# Altium schematic sheet Module_blk.SchDoc
size A4; Engineer: JBayalas; DocumentNumber: 5; Revision: V2.0; SheetNumber: 5; SheetTotal: 14
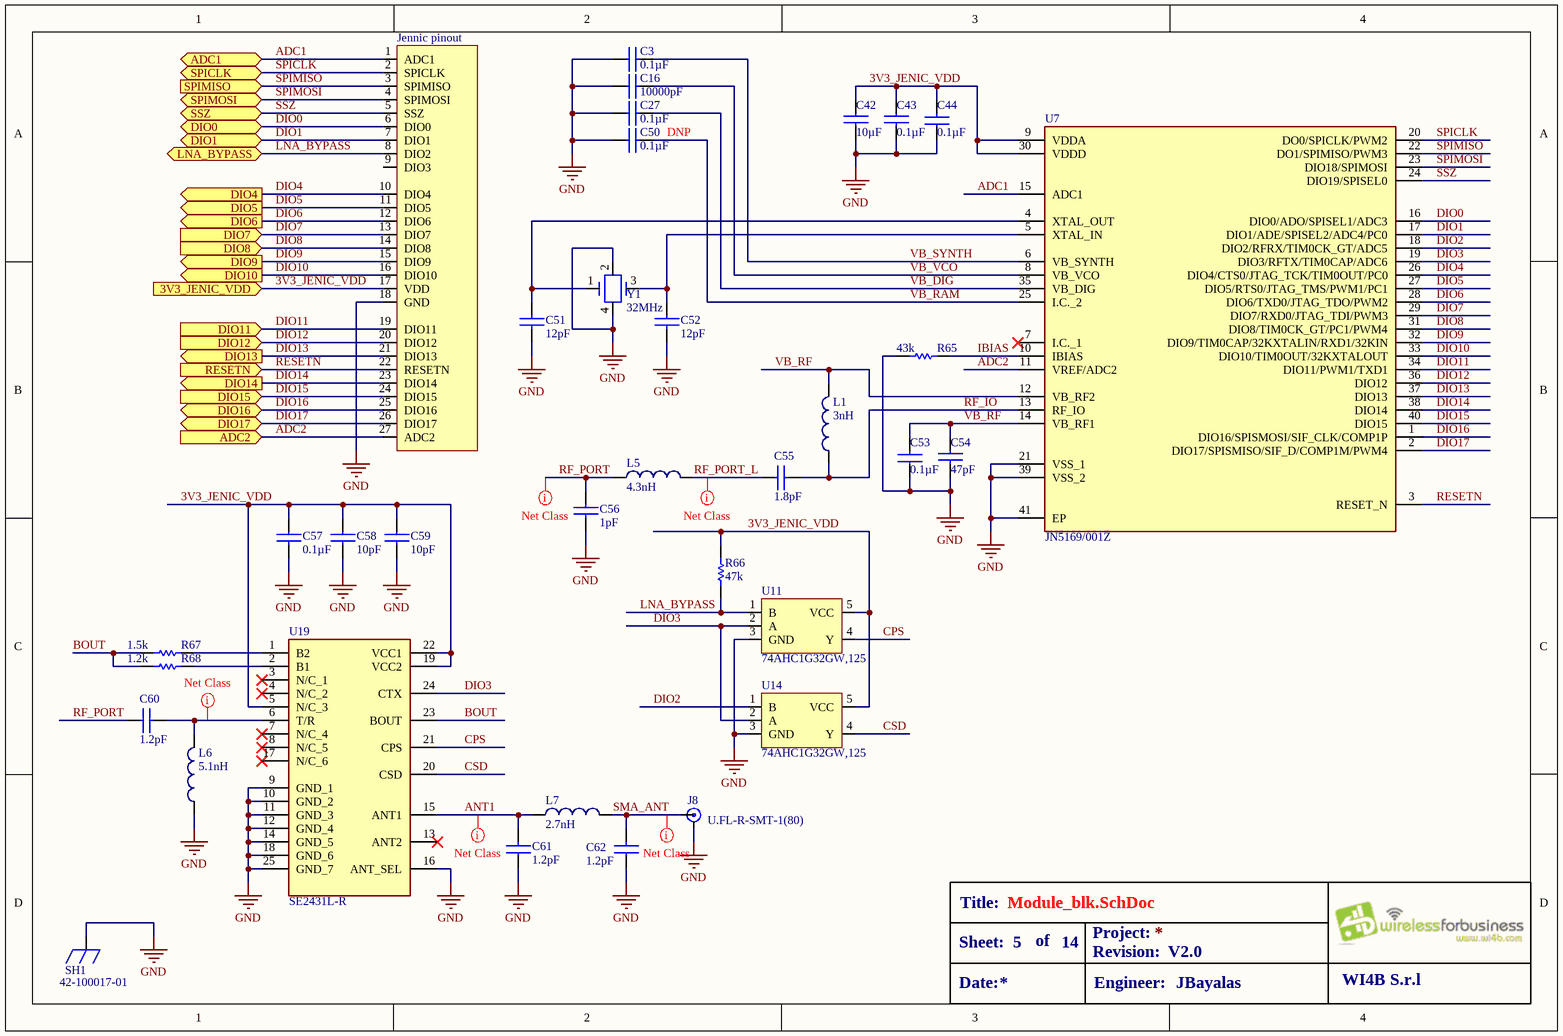
[diagram p0: Module_blk.SchDoc]

## Parts
C3  value 0.1µF  [C0402]  (hidden comment: GRM155R71H104ME14D)
C16  value 10000pF  [C0402]  (hidden comment: GRM155R71E103KA01D)
C27  value 0.1µF  [C0402]  (hidden comment: GRM155R71H104ME14D)
C42  value 10µF  [CAPC2012X135N]  (hidden comment: GRT21BR61A106KE01L)
C43  value 0.1µF  [C0402]  (hidden comment: GRM155R71H104ME14D)
C44  value 0.1µF  [C0402]  (hidden comment: GRM155R71H104ME14D)
C50  value 0.1µF  LOAD: DNP  [C0402]  (hidden comment: GRM155R71H104ME14D)
C51  value 12pF  [CAPC1005X55N]  (hidden comment: GRM1555C1H120JA01D)
C52  value 12pF  [CAPC1005X55N]  (hidden comment: GRM1555C1H120JA01D)
C53  value 0.1µF  [C0402]  (hidden comment: GRM155R71H104ME14D)
C54  value 47pF  [CAPC1005X55N]  (hidden comment: GRM1555C1H470JA01D)
C55  value 1.8pF  [CAPC1005X55N]  (hidden comment: GRM1555C1H1R8CA01D)
C56  value 1pF  [CAPC1005X55N]  (hidden comment: GRM1555C1H1R0CA01D)
C57  value 0.1µF  [C0402]  (hidden comment: GRM155R71H104ME14D)
C58  value 10pF  [C0402]  (hidden comment: GRM1555C1H100JA01D)
C59  value 10pF  [C0402]  (hidden comment: GRM1555C1H100JA01D)
C60  value 1.2pF  [CAPC1005X55N]  (hidden comment: GRM1555C1H1R2CA01D)
C61  value 1.2pF  [CAPC1005X55N]  (hidden comment: GRM1555C1H1R2CA01D)
C62  value 1.2pF  [CAPC1005X55N]  (hidden comment: GRM1555C1H1R2CA01D)
J8  U.FL-R-SMT-1(80)  [HIROSE_U.FL-R-SMT]
Jennic_pinout  Jennic pinout  [JN516X PINOUT]  (value not drawn)
L1  value 3nH  [INDC1005X45N]  (hidden comment: LQP15MN3N0B02D)
L5  value 4.3nH  [INDC1005X45N]  (hidden comment: LQP15MN4N3B02D)
L6  value 5.1nH  [INDC1005X45N]  (hidden comment: LQP15MN5N1B02D)
L7  value 2.7nH  [INDC1005X45N]  (hidden comment: LQP15MN2N7B02D)
R65  value 43k  [RESC1005X40N]  (hidden comment: RC0402FR-0743KL)
R66  value 47k  [R0402]  (hidden comment: RC0402FR-0747KL)
R67  value 1.5k  [RESC1005X40N]  (hidden comment: RC0402FR-071K5L)
R68  value 1.2k  [RESC1005X40N]  (hidden comment: RC0402FR-071K2L)
SH1  42-100017-01  [42-100017-01(Shield)]
U7  JN5169/001Z  [QFN50P600X600X100-41N]
U11  74AHC1G32GW,125  [SOT65P210X110-5N]
U14  74AHC1G32GW,125  [SOT65P210X110-5N]
U19  SE2431L-R  [QFN40P300X400X90-25N-D]
Y1  value 32MHz  [OSCCC320X250X80L75X100N]  (hidden comment: ABM8-32.000MHZ-9-D1G-T)

## Ports
3V3_JENIC_VDD (in), ADC1 (bidir), ADC2 (in), DIO0 (bidir), DIO1 (bidir), DIO4 (out), DIO5 (out), DIO6 (out), DIO7 (in), DIO8 (in), DIO9 (out), DIO10 (out), DIO11 (in), DIO12 (in), DIO13 (out), DIO14 (out), DIO15 (in), DIO16 (bidir), DIO17 (bidir), LNA_BYPASS (bidir), RESETN (in), SPICLK (bidir), SPIMISO (in), SPIMOSI (bidir), SSZ (bidir)

## Nets
GND: C3.1 C16.1 C27.1 C42.2 C43.2 C44.1 C50.1 C51.2 C52.2 C53.1 C54.2 C56.2 C57.2 C58.2 C59.2 C61.1 C62.1 J8.2(GND) Jennic_pinout.18(GND) L6.2 R65.1 SH1.1 U7.21(VSS_1) U7.39(VSS_2) U7.41(EP) U11.3(GND) U14.3(GND) U19.9(GND_1) U19.10(GND_2) U19.11(GND_3) U19.12(GND_4) U19.14(GND_5) U19.16(ANT_SEL) U19.18(GND_6) U19.25(GND_7) Y1.2 Y1.4
3V3_JENIC_VDD: C42.1 C43.1 C44.2 C57.1 C58.1 C59.1 Jennic_pinout.17(VDD) R66.2 U7.9(VDDA) U7.30(VDDD) U11.5(VCC) U14.5(VCC) U19.5(N/C_3) U19.19(VCC2) U19.22(VCC1) ; port 3V3_JENIC_VDD
ADC1: Jennic_pinout.1(ADC1) U7.15(ADC1) ; port ADC1
ADC2: Jennic_pinout.27(ADC2) U7.11(VREF/ADC2) ; port ADC2
ANT1: C61.2 L7.2 U19.15(ANT1)
BOUT: R67.1 R68.1 U19.23(BOUT)
CPS: U11.4(Y) U19.21(CPS)
CSD: U14.4(Y) U19.20(CSD)
DIO0: Jennic_pinout.6(DIO0) U7.16(DIO0/ADO/SPISEL1/ADC3) ; port DIO0
DIO1: Jennic_pinout.7(DIO1) U7.17(DIO1/ADE/SPISEL2/ADC4/PC0) ; port DIO1
DIO2: U7.18(DIO2/RFRX/TIM0CK_GT/ADC5) U14.1(B)
DIO3: U7.19(DIO3/RFTX/TIM0CAP/ADC6) U11.2(A) U14.2(A) U19.24(CTX)
DIO4: Jennic_pinout.10(DIO4) U7.26(DIO4/CTS0/JTAG_TCK/TIM0OUT/PC0) ; port DIO4
DIO5: Jennic_pinout.11(DIO5) U7.27(DIO5/RTS0/JTAG_TMS/PWM1/PC1) ; port DIO5
DIO6: Jennic_pinout.12(DIO6) U7.28(DIO6/TXD0/JTAG_TDO/PWM2) ; port DIO6
DIO7: Jennic_pinout.13(DIO7) U7.29(DIO7/RXD0/JTAG_TDI/PWM3) ; port DIO7
DIO8: Jennic_pinout.14(DIO8) U7.31(DIO8/TIM0CK_GT/PC1/PWM4) ; port DIO8
DIO9: Jennic_pinout.15(DIO9) U7.32(DIO9/TIM0CAP/32KXTALIN/RXD1/32KIN) ; port DIO9
DIO10: Jennic_pinout.16(DIO10) U7.33(DIO10/TIM0OUT/32KXTALOUT) ; port DIO10
DIO11: Jennic_pinout.19(DIO11) U7.34(DIO11/PWM1/TXD1) ; port DIO11
DIO12: Jennic_pinout.20(DIO12) U7.36(DIO12) ; port DIO12
DIO13: Jennic_pinout.21(DIO13) U7.37(DIO13) ; port DIO13
DIO14: Jennic_pinout.23(DIO14) U7.38(DIO14) ; port DIO14
DIO15: Jennic_pinout.24(DIO15) U7.40(DIO15) ; port DIO15
DIO16: Jennic_pinout.25(DIO16) U7.1(DIO16/SPISMOSI/SIF_CLK/COMP1P) ; port DIO16
DIO17: Jennic_pinout.26(DIO17) U7.2(DIO17/SPISMISO/SIF_D/COMP1M/PWM4) ; port DIO17
IBIAS: R65.2 U7.10(IBIAS)
LNA_BYPASS: Jennic_pinout.8(DIO2) R66.1 U11.1(B) ; port LNA_BYPASS
RESETN: Jennic_pinout.22(RESETN) U7.3(RESET_N) ; port RESETN
RF_IO: C55.2 L1.2 U7.13(RF_IO)
RF_PORT: C56.1 C60.1 L5.2
RF_PORT_L: C55.1 L5.1
SMA_ANT: C62.2 J8.1(SIGNAL) L7.1
SPICLK: Jennic_pinout.2(SPICLK) U7.20(DO0/SPICLK/PWM2) ; port SPICLK
SPIMISO: Jennic_pinout.3(SPIMISO) U7.22(DO1/SPIMISO/PWM3) ; port SPIMISO
SPIMOSI: Jennic_pinout.4(SPIMOSI) U7.23(DIO18/SPIMOSI) ; port SPIMOSI
SSZ: Jennic_pinout.5(SSZ) U7.24(DIO19/SPISEL0) ; port SSZ
VB_DIG: C27.2 U7.35(VB_DIG)
VB_RAM: C50.2 U7.25(I.C._2)
VB_RF: C53.2 C54.1 L1.1 U7.12(VB_RF2) U7.14(VB_RF1)
VB_SYNTH: C3.2 U7.6(VB_SYNTH)
VB_VCO: C16.2 U7.8(VB_VCO)
NetC51_1: C51.1 U7.4(XTAL_OUT) Y1.1
NetC52_1: C52.1 U7.5(XTAL_IN) Y1.3
NetC60_2: C60.2 L6.1 U19.6(T/R)
NetR67_2: R67.2 U19.1(B2)
NetR68_2: R68.2 U19.2(B1)

Not connected (* = marked no-connect by the designer): Jennic_pinout 9(DIO3); U7 7(I.C._1)*; U19 3(N/C_1)* 4(N/C_2)* 7(N/C_4)* 8(N/C_5)* 13(ANT2)* 17(N/C_6)*

## Layout directives
net class 50 OHMS: ANT1, NetC60_2, RF_PORT, RF_PORT_L, SMA_ANT

## Notes on the sheet
- Title:
- Sheet:
- Date:
- of
- Project:
- Revision:
- Engineer:
- WI4B S.r.l

## Library data of the parts
C3 C27 C43 C44 C50 C53 C57 = GRM155R71H104ME14D: CAP CER 0.1UF 50V X7R 0402; MFT: Murata Electronics North America; TYPE: SMD; FUNCTION: JN5169 Module; MPN: GRM155R71H104ME14D; RATING: 50V
  C3 C27 C43 C44 C53 C57: LOAD: *
C16 = GRM155R71E103KA01D: CAP CER 10000PF 25V X7R 0402; MFT: Murata Electronics North America; TYPE: SMD; FUNCTION: JN5169 Module; MPN: GRM155R71E103KA01D; RATING: 25V; LOAD: *
C42 = GRT21BR61A106KE01L: CAP CER 10UF 10V X5R 0805; MFT: Murata; TYPE: SMD; FUNCTION: JN5169 Module; MPN: GRT21BR61A106KE01L; LOAD: *; RATING: 10V; APN: *
C51 C52 = GRM1555C1H120JA01D: CAP CER 12PF 50V C0G/NP0 0402; MFT: Murata; TYPE: SMD; FUNCTION: JN5169 Module; MPN: GRM1555C1H120JA01D; APN: *; RATING: 50V; LOAD: *
C54 = GRM1555C1H470JA01D: CAP CER 47PF 50V C0G/NP0 0402; MFT: Murata; TYPE: SMD; FUNCTION: JN5169 Module; MPN: GRM1555C1H470JA01D; APN: *; RATING: 50V; LOAD: *
C55 = GRM1555C1H1R8CA01D: CAP CER 1.8PF 50V C0G/NP0 0402; MFT: Murata; TYPE: SMD; FUNCTION: JN5169 Module; MPN: GRM1555C1H1R8CA01D; LOAD: *; RATING: 50V; APN: *
C56 = GRM1555C1H1R0CA01D: CAP CER 1PF 50V C0G/NP0 0402; MFT: Murata; TYPE: SMD; FUNCTION: JN5169 Module; MPN: GRM1555C1H1R0CA01D; APN: *; LOAD: *; RATING: 50V
C58 C59 = GRM1555C1H100JA01D: CAP CER 10PF 50V 5% NP0 0402; MFT: Murata Electronics North America; TYPE: Surface Mount; FUNCTION: JN5169 Module; MPN: GRM1555C1H100JA01D; RATING: 50V
C60-C62 = GRM1555C1H1R2CA01D: CAP CER 1.2PF 50V C0G/NP0 0402; MFT: Murata; TYPE: SMD; FUNCTION: JN5169 Module; MPN: GRM1555C1H1R2CA01D; RATING: 50V; LOAD: *; APN: *
J8 = U.FL-R-SMT-1(80): RF Connectors / Coaxial Connectors SMT MALE RECEPT AU; MFT: Hirose; APN: JX-001UFL-80; FUNCTION: JN5169 Module; MPN: U.FL-R-SMT-1(80); RATING: *; LOAD: *; TYPE: SMD; VALUE: U.FL-R-SMT-1(80)
Jennic_pinout = Jennic pinout: FUNCTION: JN5169 Module; MPN: Jennic Pinout
L1 = LQP15MN3N0B02D: FIXED IND 3NH 190MA 400 MOHM SMD; MFT: Murata; APN: LZ-00030-L7-00; FUNCTION: JN5169 Module; MPN: LQP15MN3N0B02D; RATING: *; LOAD: *; TYPE: SMD
L5 = LQP15MN4N3B02D: FIXED IND 4.3NH 160MA 600 MOHM; MFT: Murata; APN: LZ-00431-L7-00; FUNCTION: JN5169 Module; MPN: LQP15MN4N3B02D; RATING: *; TYPE: *; LOAD: *
L6 = LQP15MN5N1B02D: Inductor RF Chip ThFIXED IND 5.1NH 140MA 700 MOHM; MFT: Murata; TYPE: SMD; APN: LZ-00511-L7-00; FUNCTION: JN5169 Module; MPN: LQP15MN5N1B02D; RATING: *; LOAD: *
L7 = LQP15MN2N7B02D: FIXED IND 2.7NH 220MA 300 MOHM; MFT: Murata; APN: LZ-00271-L7-00; TYPE: SMD; FUNCTION: JN5169 Module; MPN: LQP15MN2N7B02D; RATING: *; LOAD: *
R65 = RC0402FR-0743KL: RES SMD 43K OHM 1% 1/16W 0402; MFT: Yageo; APN: RQ-0433-R7-C; FUNCTION: JN5169 Module; MPN: RC0402FR-0743KL; RATING: 1/16W; LOAD: *; TYPE: SMD
R66 = RC0402FR-0747KL: RES SMD 47K OHM 1% 1/16W 0402; MFT: Yageo; APN: RQ-0473-R7-C; FUNCTION: JN5169 Module; MPN: RC0402FR-0747KL; LOAD: *; TYPE: SMD; RATING: 1/16W
R67 = RC0402FR-071K5L: RES SMD 1.5K OHM 1% 1/16W 0402; MFT: Yageo; APN: RQ-0154-R7-C; FUNCTION: JN5169 Module; MPN: RC0402FR-071K5L; TYPE: SMD; RATING: 1% 1/16W; LOAD: *
R68 = RC0402FR-071K2L: RES SMD 1.2K OHM 1% 1/16W 0402; MFT: Yageo; FUNCTION: JN5169 Module; MPN: RC0402FR-071K2L; APN: *; RATING: 1/16W; LOAD: *; TYPE: SMD
SH1 = 42-100017-01: Shield; MFT: TSC; FUNCTION: JN5169 Module; APN: *; RATING: *; LOAD: *; TYPE: SMD; MPN: 42-100017-01; VALUE: 42-100017-01
U7 = JN5169/001Z: IC RF TXRX+MCU 802.15.4 40-VFQFN; MFT: NXP Semiconductors; APN: U8-JN5169-X1-01; FUNCTION: JN5169 Module; MPN: JN5169/001Z; LOAD: *; TYPE: SMD; RATING: *; VALUE: JN5169/001Z
U11 U14 = 74AHC1G32GW,125: IC GATE OR 1CH 2-INP 5TSSOP; MFT: Nexperia; APN: UE-74AHC1G32-X1; FUNCTION: JN5169 Module; MPN: 74AHC1G32GW,125; LOAD: *; TYPE: SMD; RATING: *; VALUE: 74AHC1G32GW,125
U19 = SE2431L-R: IC RF FRONT END MOD 2.4GHZ 24QFN; MFT: Skyworks; APN: U8-SE2431L-X1; FUNCTION: JN5169 Module; MPN: SE2431L-R; RATING: *; TYPE: SMD; LOAD: *; VALUE: SE2431L-R
Y1 = ABM8-32.000MHZ-9-D1G-T: CRYSTAL 32.0000MHZ 9PF SMD; MFT: Abracon; APN: XZ-00326FH; FUNCTION: JN5169 Module; MPN: ABM8-32.000MHZ-9-D1G-T; RATING: *; LOAD: *; TYPE: SMD